# Altium project Flexy_PCB.PrjPcb
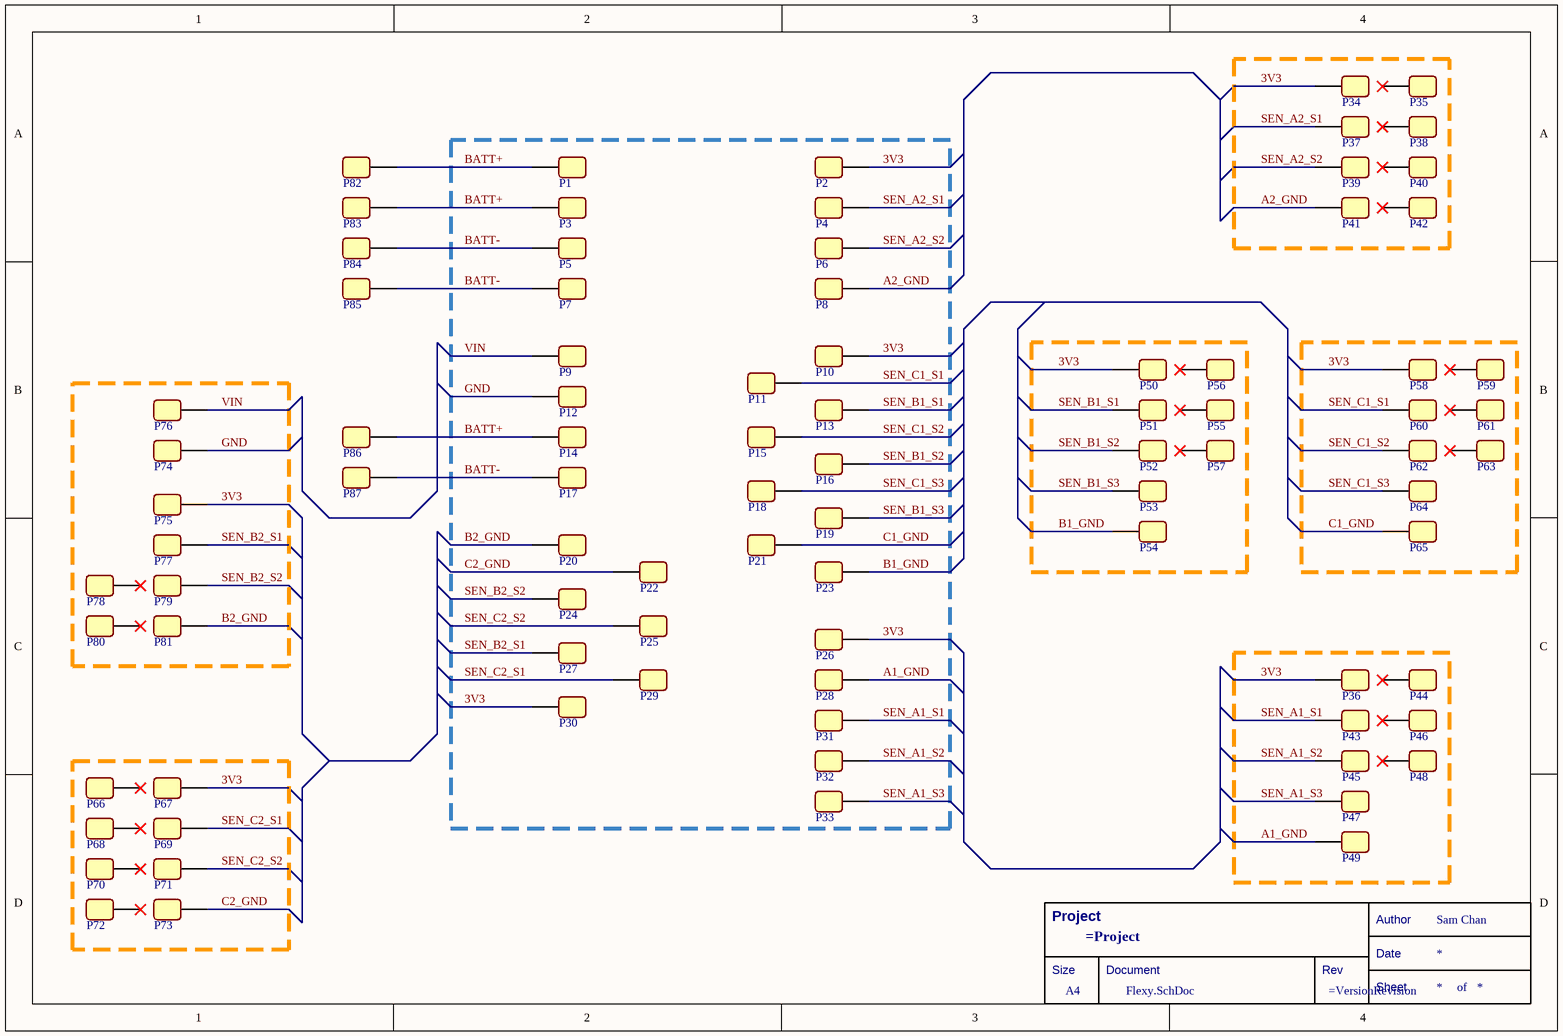
[diagram p0: Flexy.SchDoc]
1 sheet, 88 parts. Net scope: global (net labels, ports and power ports of the same name join across sheets).
Board file: Flexy.PcbDoc

## Sheet Flexy.SchDoc
size A4

### Parts
*  Title Block  (value not drawn)  (graphical)
P1  PAD_4  [PAD_0.5X1MM]  (value not drawn)  (no BOM)
P2  PAD_4  [PAD_0.5X1MM]  (value not drawn)  (no BOM)
P3  PAD_4  [PAD_0.5X1MM]  (value not drawn)  (no BOM)
P4  PAD_4  [PAD_0.5X1MM]  (value not drawn)  (no BOM)
P5  PAD_4  [PAD_0.5X1MM]  (value not drawn)  (no BOM)
P6  PAD_4  [PAD_0.5X1MM]  (value not drawn)  (no BOM)
P7  PAD_4  [PAD_0.5X1MM]  (value not drawn)  (no BOM)
P8  PAD_4  [PAD_0.5X1MM]  (value not drawn)  (no BOM)
P9  PAD_4  [PAD_0.5X1MM]  (value not drawn)  (no BOM)
P10  PAD_4  [PAD_0.5X1MM]  (value not drawn)  (no BOM)
P11  PAD_4  [PAD_0.5X1MM]  (value not drawn)  (no BOM)
P12  PAD_4  [PAD_0.5X1MM]  (value not drawn)  (no BOM)
P13  PAD_4  [PAD_0.5X1MM]  (value not drawn)  (no BOM)
P14  PAD_4  [PAD_0.5X1MM]  (value not drawn)  (no BOM)
P15  PAD_4  [PAD_0.5X1MM]  (value not drawn)  (no BOM)
P16  PAD_4  [PAD_0.5X1MM]  (value not drawn)  (no BOM)
P17  PAD_4  [PAD_0.5X1MM]  (value not drawn)  (no BOM)
P18  PAD_4  [PAD_0.5X1MM]  (value not drawn)  (no BOM)
P19  PAD_4  [PAD_0.5X1MM]  (value not drawn)  (no BOM)
P20  PAD_4  [PAD_0.5X1MM]  (value not drawn)  (no BOM)
P21  PAD_4  [PAD_0.5X1MM]  (value not drawn)  (no BOM)
P22  PAD_4  [PAD_0.5X1MM]  (value not drawn)  (no BOM)
P23  PAD_4  [PAD_0.5X1MM]  (value not drawn)  (no BOM)
P24  PAD_4  [PAD_0.5X1MM]  (value not drawn)  (no BOM)
P25  PAD_4  [PAD_0.5X1MM]  (value not drawn)  (no BOM)
P26  PAD_4  [PAD_0.5X1MM]  (value not drawn)  (no BOM)
P27  PAD_4  [PAD_0.5X1MM]  (value not drawn)  (no BOM)
P28  PAD_4  [PAD_0.5X1MM]  (value not drawn)  (no BOM)
P29  PAD_4  [PAD_0.5X1MM]  (value not drawn)  (no BOM)
P30  PAD_4  [PAD_0.5X1MM]  (value not drawn)  (no BOM)
P31  PAD_4  [PAD_0.5X1MM]  (value not drawn)  (no BOM)
P32  PAD_4  [PAD_0.5X1MM]  (value not drawn)  (no BOM)
P33  PAD_4  [PAD_0.5X1MM]  (value not drawn)  (no BOM)
P34  PAD_4  [PAD_0.5X1MM]  (value not drawn)  (no BOM)
P35  PAD_4  [PAD_0.5X1MM]  (value not drawn)  (no BOM)
P36  PAD_4  [PAD_0.5X1MM]  (value not drawn)  (no BOM)
P37  PAD_4  [PAD_0.5X1MM]  (value not drawn)  (no BOM)
P38  PAD_4  [PAD_0.5X1MM]  (value not drawn)  (no BOM)
P39  PAD_4  [PAD_0.5X1MM]  (value not drawn)  (no BOM)
P40  PAD_4  [PAD_0.5X1MM]  (value not drawn)  (no BOM)
P41  PAD_4  [PAD_0.5X1MM]  (value not drawn)  (no BOM)
P42  PAD_4  [PAD_0.5X1MM]  (value not drawn)  (no BOM)
P43  PAD_4  [PAD_0.5X1MM]  (value not drawn)  (no BOM)
P44  PAD_4  [PAD_0.5X1MM]  (value not drawn)  (no BOM)
P45  PAD_4  [PAD_0.5X1MM]  (value not drawn)  (no BOM)
P46  PAD_4  [PAD_0.5X1MM]  (value not drawn)  (no BOM)
P47  PAD_4  [PAD_0.5X1MM]  (value not drawn)  (no BOM)
P48  PAD_4  [PAD_0.5X1MM]  (value not drawn)  (no BOM)
P49  PAD_4  [PAD_0.5X1MM]  (value not drawn)  (no BOM)
P50  PAD_4  [PAD_0.5X1MM]  (value not drawn)  (no BOM)
P51  PAD_4  [PAD_0.5X1MM]  (value not drawn)  (no BOM)
P52  PAD_4  [PAD_0.5X1MM]  (value not drawn)  (no BOM)
P53  PAD_4  [PAD_0.5X1MM]  (value not drawn)  (no BOM)
P54  PAD_4  [PAD_0.5X1MM]  (value not drawn)  (no BOM)
P55  PAD_4  [PAD_0.5X1MM]  (value not drawn)  (no BOM)
P56  PAD_4  [PAD_0.5X1MM]  (value not drawn)  (no BOM)
P57  PAD_4  [PAD_0.5X1MM]  (value not drawn)  (no BOM)
P58  PAD_4  [PAD_0.5X1MM]  (value not drawn)  (no BOM)
P59  PAD_4  [PAD_0.5X1MM]  (value not drawn)  (no BOM)
P60  PAD_4  [PAD_0.5X1MM]  (value not drawn)  (no BOM)
P61  PAD_4  [PAD_0.5X1MM]  (value not drawn)  (no BOM)
P62  PAD_4  [PAD_0.5X1MM]  (value not drawn)  (no BOM)
P63  PAD_4  [PAD_0.5X1MM]  (value not drawn)  (no BOM)
P64  PAD_4  [PAD_0.5X1MM]  (value not drawn)  (no BOM)
P65  PAD_4  [PAD_0.5X1MM]  (value not drawn)  (no BOM)
P66  PAD_4  [PAD_0.5X1MM]  (value not drawn)  (no BOM)
P67  PAD_4  [PAD_0.5X1MM]  (value not drawn)  (no BOM)
P68  PAD_4  [PAD_0.5X1MM]  (value not drawn)  (no BOM)
P69  PAD_4  [PAD_0.5X1MM]  (value not drawn)  (no BOM)
P70  PAD_4  [PAD_0.5X1MM]  (value not drawn)  (no BOM)
P71  PAD_4  [PAD_0.5X1MM]  (value not drawn)  (no BOM)
P72  PAD_4  [PAD_0.5X1MM]  (value not drawn)  (no BOM)
P73  PAD_4  [PAD_0.5X1MM]  (value not drawn)  (no BOM)
P74  PAD_4  [PAD_0.5X1MM]  (value not drawn)  (no BOM)
P75  PAD_4  [PAD_0.5X1MM]  (value not drawn)  (no BOM)
P76  PAD_4  [PAD_0.5X1MM]  (value not drawn)  (no BOM)
P77  PAD_4  [PAD_0.5X1MM]  (value not drawn)  (no BOM)
P78  PAD_4  [PAD_0.5X1MM]  (value not drawn)  (no BOM)
P79  PAD_4  [PAD_0.5X1MM]  (value not drawn)  (no BOM)
P80  PAD_4  [PAD_0.5X1MM]  (value not drawn)  (no BOM)
P81  PAD_4  [PAD_0.5X1MM]  (value not drawn)  (no BOM)
P82  PAD_4  [PAD_0.5X1MM]  (value not drawn)  (no BOM)
P83  PAD_4  [PAD_0.5X1MM]  (value not drawn)  (no BOM)
P84  PAD_4  [PAD_0.5X1MM]  (value not drawn)  (no BOM)
P85  PAD_4  [PAD_0.5X1MM]  (value not drawn)  (no BOM)
P86  PAD_4  [PAD_0.5X1MM]  (value not drawn)  (no BOM)
P87  PAD_4  [PAD_0.5X1MM]  (value not drawn)  (no BOM)

### Nets
3V3: P2.1 P10.1 P26.1 P30.1 P34.1 P36.1 P50.1 P58.1 P67.1 P75.1
A1_GND: P28.1 P49.1
A2_GND: P8.1 P41.1
B1_GND: P23.1 P54.1
B2_GND: P20.1 P81.1
BATT+: P1.1 P3.1 P14.1 P82.1 P83.1 P86.1
BATT-: P5.1 P7.1 P17.1 P84.1 P85.1 P87.1
C1_GND: P21.1 P65.1
C2_GND: P22.1 P73.1
GND: P12.1 P74.1
SEN_A1_S1: P31.1 P43.1
SEN_A1_S2: P32.1 P45.1
SEN_A1_S3: P33.1 P47.1
SEN_A2_S1: P4.1 P37.1
SEN_A2_S2: P6.1 P39.1
SEN_B1_S1: P13.1 P51.1
SEN_B1_S2: P16.1 P52.1
SEN_B1_S3: P19.1 P53.1
SEN_B2_S1: P27.1 P77.1
SEN_B2_S2: P24.1 P79.1
SEN_C1_S1: P11.1 P60.1
SEN_C1_S2: P15.1 P62.1
SEN_C1_S3: P18.1 P64.1
SEN_C2_S1: P29.1 P69.1
SEN_C2_S2: P25.1 P71.1
VIN: P9.1 P76.1

Not connected (* = marked no-connect by the designer): P35 1*; P38 1*; P40 1*; P42 1*; P44 1*; P46 1*; P48 1*; P55 1*; P56 1*; P57 1*; P59 1*; P61 1*; P63 1*; P66 1*; P68 1*; P70 1*; P72 1*; P78 1*; P80 1*

### Notes on the sheet
- (in symbol Title Block) Project; Author; Sam Chan; Date; Size; Document; Rev; A4; Sheet; of

### Library data of the parts
* = Title Block: Standard Title Block
P1-P87 = PAD_4: a Rec pad, 0.5X1mm